# Altium schematic sheet ADC-SYNC INPUT.SchDoc: <SPECIFIC SHEET FUNCTION>
size A3; Date: DO NOT USE, RATHER USE PROJ OPTIONS; DrawnBy: DO NOT USE, RATHER USE PROJ OPTIONS; Engineer: DO NOT USE, RATHER USE PROJ OPTIONS; Organization: DO NOT USE, RATHER USE PROJ OPTIONS; DocumentNumber: 9; Revision: DO NOT USE, RATHER USE PROJ OPTIONS; SheetNumber: 7; SheetTotal: 12; SCH_Sheet_Filename: ADC-SYNC INPUT.SchDoc; CurrentTime: DO NOT USE, RATHER USE PROJ OPTIONS; Time: DO NOT USE, RATHER USE PROJ OPTIONS; DocumentFullPathAndName: DO NOT USE, RATHER USE PROJ OPTIONS; DocumentName: DO NOT USE, RATHER USE PROJ OPTIONS; ModifiedDate: DO NOT USE, RATHER USE PROJ OPTIONS; ImagePath: DO NOT USE, RATHER USE PROJ OPTIONS
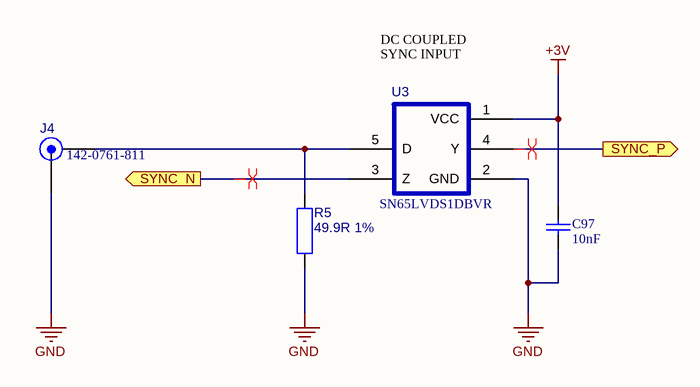
[diagram p0: ADC-SYNC INPUT.SchDoc]

## Parts
C97  value 10nF  [CAPC1005X55N]  (hidden comment: Capacitor 0402 SMD)
J4  142-0761-811  [EDGE_LAUNCH_TH_SMA]
R5  49.9R 1%  [0603]
U3  SN65LVDS1DBVR  [SOT95P280X145-5N]

## Ports
SYNC_N (out), SYNC_P (out)

## Nets
+3V: C97.2 U3.1(VCC)
GND: C97.1 J4.2 R5.2 U3.2(GND)
SYNC_N: U3.3(Z) ; port SYNC_N
SYNC_P: U3.4(Y) ; port SYNC_P
NetJ4_1: J4.1 R5.1 U3.5(D)

## Layout directives
differential pair: SYNC_N, SYNC_P

## Notes on the sheet
- DC COUPLED SYNC INPUT
- 2009   THIS DOCUMENT IS THE PROPERTY OF THE OWNER, AND MAY NOT BE COPIED OR USED FOR ANY PURPOSE OTHER THAN THAT FOR WHICH IT IS SUPPLIED WITHOUT PERMISSION IN WRITING FROM THE OWNER.
- C
- DATESTAMP OF THIS PRINT
- DRAWN BY:
- DOCUMENT NUMBER:
- SCHEMATIC FILENAME:
- PCB FILENAME:
- ENGINEER:
- APPROVED:
- CIRCUIT DIAGRAM
- DATE
- SHEET
- REVISION
- OF

## Library data of the parts
C97 = cap0402: Created_By: EDA-ASA; Checked_By: *; Checked_Date: *; HelpURL: *; Supplier1: *; Supplier2: *; Unit_Cost: *; MOQ: *; Leadtime: *; Inventory_Stock: *; Tolerance: *; Wattage: *; Package: 0402; ComponentLinked1Description: *; ComponentLinked1URL: *; ComponentLinked2Description: *; ComponentLinked2URL: *; ComponentLinked3Description: *; ComponentLinked3URL: *; ComponentLinked4Description: *; ComponentLinked4URL: *
J4 = 142-0761-811: High Frequency SMA End Lauch Connector; Manufacturer: JOHNSON; Created_By: CT; Checked_By: *; Checked_Date: *; HelpURL: *; ComponentLink1Description: High Frequency SMA End Lauch Connector; ComponentLink1URL: *; ComponentLink2Description: Application Note; ComponentLink2URL: *; ComponentLink3Description: Layout Guidelines; ComponentLink3URL: *; ComponentLink4Description: Technology Reference; ComponentLink4URL: *; Supplier1: *; Supplier2: *; Unit_Cost: *; MOQ: *; Leadtime: *; Inventory_Stock: *; Tolerance: *; Wattage: *; Package: *; ComponentLink5Description: Production Detail; ComponentLink5URL: *; Note: *; Stock Code: *; Voltage: *; Manufacturer_PN: 142-0761-811
R5 = RES-0805: RESISTOR SMD 0603; Checked_By: NN; Manufacturer: *; Manufacturer_PN: *; Created_By: *; Checked_Date: 5-08-2009; HelpURL: *; ComponentLink1Description: Footprint Detail; ComponentLink1URL: *; ComponentLink2Description: Application Note; ComponentLink2URL: *; ComponentLink3Description: Layout Guidelines; ComponentLink3URL: *; ComponentLink4Description: Technology Reference; ComponentLink4URL: *; Supplier1: *; Supplier2: *; Unit_Cost: *; MOQ: *; Leadtime: *; Inventory_Stock: *; Tolerance: *; Wattage: *; Voltage: *; Package: 0603; ComponentLink5Description: Production Detail; ComponentLink5URL: *; Note: *; Stock Code: *; Value: 49.9R 1%
U3 = SN65LVDS1DBVR: High Speed Differential Line Driver/Receiver; Manufacturer: TI; Created_By: IN; Manufacturer_PN: SN65LVDS1DBVR; Checked_By: *; Checked_Date: *; HelpURL: X:\Datasheets\By_Manufacturer\TI\sn65lvds1.pdf; ComponentLink1Description: X:\Datasheets\By_Manufacturer\TI\sn65lvds1.pdf#page=13; ComponentLink1URL: *; ComponentLink2Description: Application Note; ComponentLink2URL: *; ComponentLink3Description: Layout Guidelines; ComponentLink3URL: *; ComponentLink4Description: Technology Reference; ComponentLink4URL: *; Supplier1: *; Supplier2: *; Unit_Cost: *; MOQ: *; Leadtime: *; Inventory_Stock: *; Tolerance: *; Wattage: *; Voltage: *; Package: *; ComponentLink5Description: Production Detail; ComponentLink5URL: *; Note: *; Stock Code: *